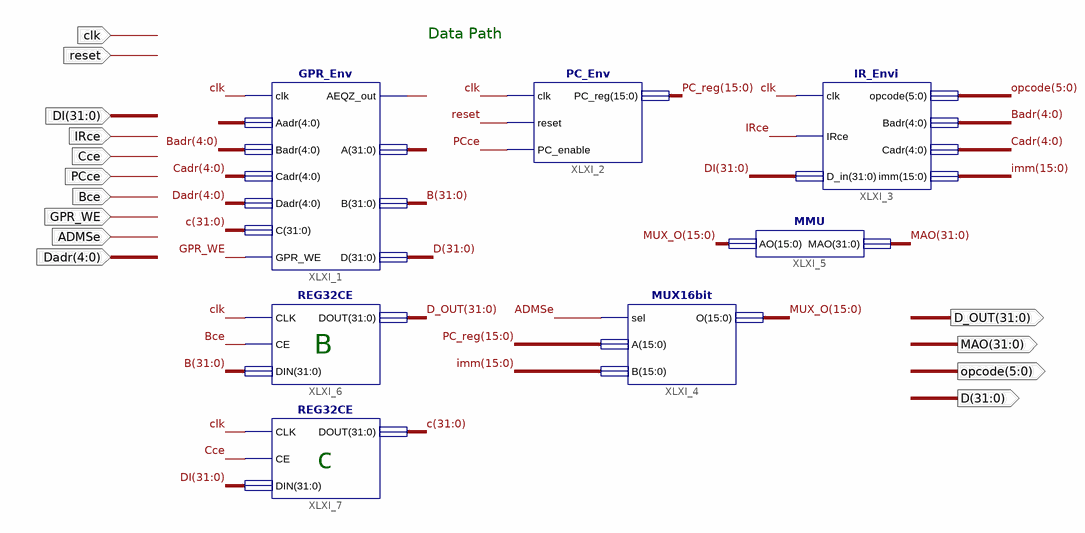
[diagram p0: schematic sheet 1]
// Xilinx ISE schematic Load_Store_Machine.sch (spartan6) as structural Verilog: 7 symbols, 14 ports
module Load_Store_Machine (
  input  clk,
  input  reset,
  input  [31:0] DI,
  input  IRce,
  input  Cce,
  input  PCce,
  input  Bce,
  input  GPR_WE,
  input  ADMSe,
  input  [4:0] Dadr,
  output [31:0] D_OUT,
  output [31:0] MAO,
  output [5:0] opcode,
  output [31:0] D
);

  wire XLXN_23;
  wire [4:0] Badr, Cadr, XLXN_17;
  wire [15:0] imm, MUX_O, PC_reg;
  wire [31:0] B, c, XLXN_24;

  GPR_Env XLXI_1 (
    .clk(clk), .Aadr(XLXN_17), .Badr(Badr), .Cadr(Cadr), .Dadr(Dadr), .C(c), .GPR_WE(GPR_WE),
    .AEQZ_out(XLXN_23), .A(XLXN_24), .B(B), .D(D));
  PC_Env XLXI_2 (.clk(clk), .reset(reset), .PC_enable(PCce), .PC_reg(PC_reg));
  IR_Envi XLXI_3 (.clk(clk), .IRce(IRce), .D_in(DI), .opcode(opcode), .Badr(Badr), .Cadr(Cadr), .imm(imm));
  MUX16bit XLXI_4 (.sel(ADMSe), .A(PC_reg), .B(imm), .O(MUX_O));
  MMU XLXI_5 (.AO(MUX_O), .MAO(MAO));
  REG32CE XLXI_6 (.CLK(clk), .CE(Bce), .DIN(B), .DOUT(D_OUT));
  REG32CE XLXI_7 (.CLK(clk), .CE(Cce), .DIN(DI), .DOUT(c));

  // Notes on the sheet:
  //   Data Path
  //   B
  //   c
endmodule
